# EAGLE design current_controller (EAGLE 8.5.0)
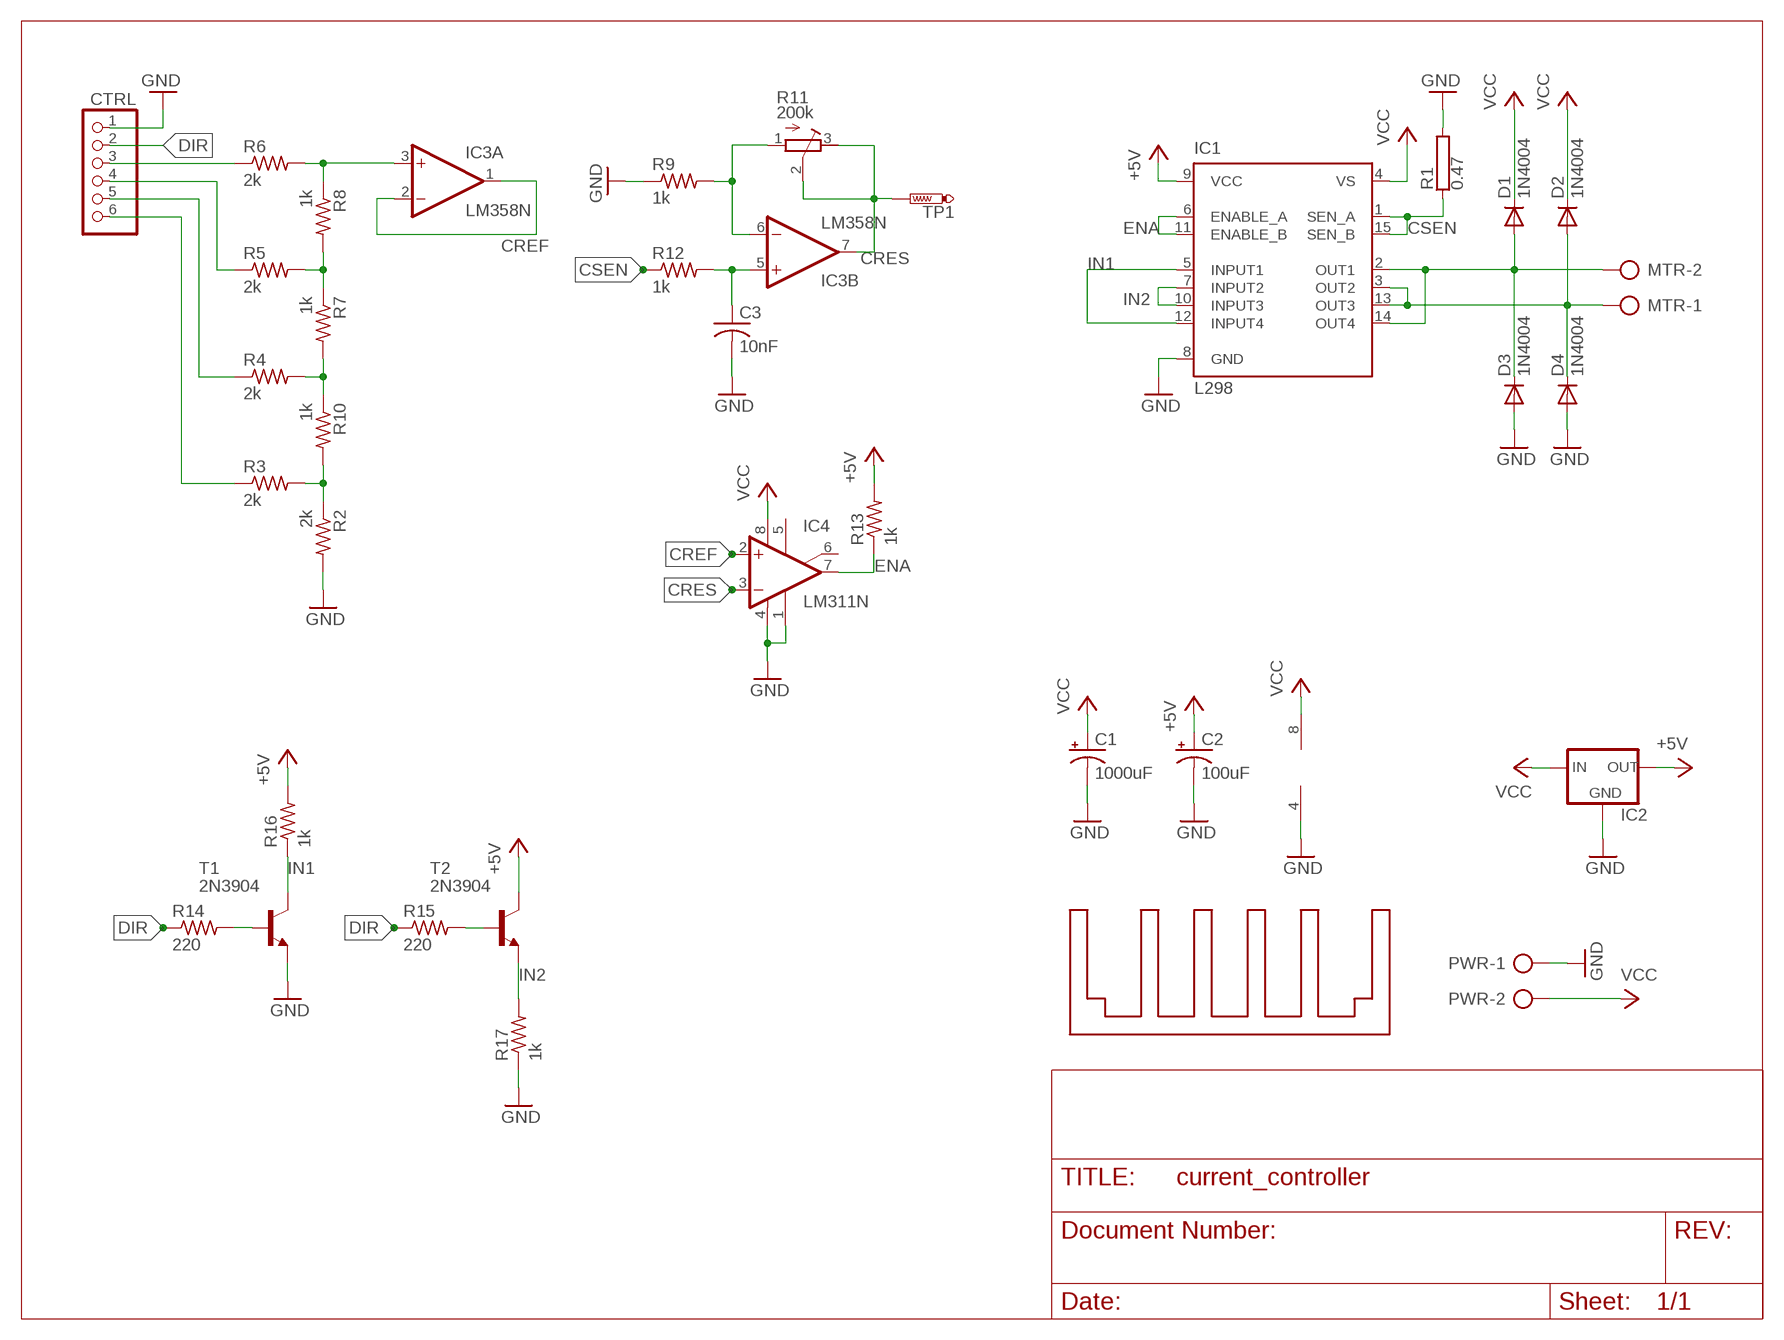
[diagram p0: schematic, sheet 1]

## Parts
C1  1000uF  CPOL-USE5-13  [E5-13]
C2  100uF  CPOL-USE5-8.5  [E5-8,5]
C3  10nF  C-US050-024X044  [C050-024X044]
CTRL  PINHD-1X6  [1X06]
D1  1N4004  [DO41-10]
D2  1N4004  [DO41-10]
D3  1N4004  [DO41-10]
D4  1N4004  [DO41-10]
IC1  L298  [MULTIWATT-15]
IC2  78XXS  [78XXS]
IC3  LM358N  [DIL08]
IC4  LM311N  [DIL08]
MTR  AK500/2  [AK500/2]
PWR  AK500/2  [AK500/2]
R1  0.47  RCA4080  [CA4080]
R2  2k  R-US_0204/7  [0204/7]
R3  2k  R-US_0204/7  [0204/7]
R4  2k  R-US_0204/7  [0204/7]
R5  2k  R-US_0204/7  [0204/7]
R6  2k  R-US_0204/7  [0204/7]
R7  1k  R-US_0204/7  [0204/7]
R8  1k  R-US_0204/7  [0204/7]
R9  1k  R-US_0204/7  [0204/7]
R10  1k  R-US_0204/7  [0204/7]
R11  200k  R-TRIMM64W  [RTRIM64W]
R12  1k  R-US_0204/7  [0204/7]
R13  1k  R-US_0204/7  [0204/7]
R14  220  R-US_0204/7  [0204/7]
R15  220  R-US_0204/7  [0204/7]
R16  1k  R-US_0204/7  [0204/7]
R17  1k  R-US_0204/7  [0204/7]
T1  2N3904  [TO92]
T2  2N3904  [TO92]
TP1  PTR1PAD1-13Y  [P1-13Y]
U$1  MULTI15_HEATSINK  [MULTI15_HEATSINK]

## Nets
+5V: C2.+ IC1.9(VCC) IC2.OUT R13.2 R16.2 T2.1(C)
CREF: IC3.1(A:OUT) IC3.2(A:-IN) IC4.2(+IN)
CRES: IC3.7(B:OUT) IC4.3(-IN) R11.2(S) R11.3(E) TP1.TP
CSEN: IC1.1(SEN_A) IC1.15(SEN_B) R1.1 R12.1
DIR: CTRL.2 R14.1 R15.1
ENA: IC1.6(ENABLE_A) IC1.11(ENABLE_B) IC4.7(OUT) R13.1
GND: C1.- C2.- C3.2 CTRL.1 D3.A D4.A IC1.8(GND) IC2.GND IC3.4(P:V-) IC4.1(GND) IC4.4(V-) PWR.1 R1.2 R2.2 R9.1 R17.1 T1.3(E)
IN1: IC1.5(INPUT1) IC1.12(INPUT4) R16.1 T1.1(C)
IN2: IC1.7(INPUT2) IC1.10(INPUT3) R17.2 T2.3(E)
N$1: D1.A D3.C IC1.2(OUT1) IC1.14(OUT4) MTR.2
N$2: D2.A D4.C IC1.3(OUT2) IC1.13(OUT3) MTR.1
N$3: R15.2 T2.2(B)
N$4: CTRL.3 R6.1
N$5: CTRL.4 R5.1
N$6: CTRL.5 R4.1
N$7: CTRL.6 R3.1
N$8: IC3.3(A:+IN) R6.2 R8.1
N$9: R5.2 R7.1 R8.2
N$10: R4.2 R7.2 R10.1
N$11: R2.1 R3.2 R10.2
N$12: IC3.6(B:-IN) R9.2 R11.1(A)
N$13: R14.2 T1.2(B)
N$16: C3.1 IC3.5(B:+IN) R12.2
VCC: C1.+ D1.C D2.C IC1.4(VS) IC2.IN IC3.8(P:V+) IC4.8(V+) PWR.2
Unconnected: IC4.5(ON) IC4.6(ON/STR)

## Library data of the parts
C1 C2 = resistor:CPOL-US: POLARIZED CAPACITOR, American symbol
C3 = resistor:C-US: CAPACITOR, American symbol
CTRL = pinhead:PINHD-1X6: PIN HEADER
D1-D4 = diode:1N4004: DIODE general purpose rectifier, 1 A
IC1 = st-microelectronics:L298: DUAL FULL-BRIDGE DRIVER; MPN: L298N; OC_FARNELL: 1589425; OC_NEWARK: 32M1527
IC2 = v-reg:78XXS: VOLTAGE REGULATOR
IC3 = linear:LM358: OP AMP also LM158; LM258; LM2904 Source: http://cache.national.com/ds/LM/LM158.pdf
IC4 = linear:LM311: COMPARATOR
MTR PWR = con-ptr500:AK500/2: CONNECTOR; OC_FARNELL: unknown; OC_NEWARK: unknown
R1 = resistor-power:R: Power Resitor; OC_FARNELL: unknown; OC_NEWARK: unknown
R2-R10 R12-R17 = resistor:R-US_: RESISTOR, American symbol
R11 = resistor:R-TRIMM: Trimm resistor
T1 T2 = transistor:2N3904: NPN TRANSISTOR
TP1 = testpad:PTR1: TEST PIN
U$1 = maplib:MULTI15_HEATSINK

## Board
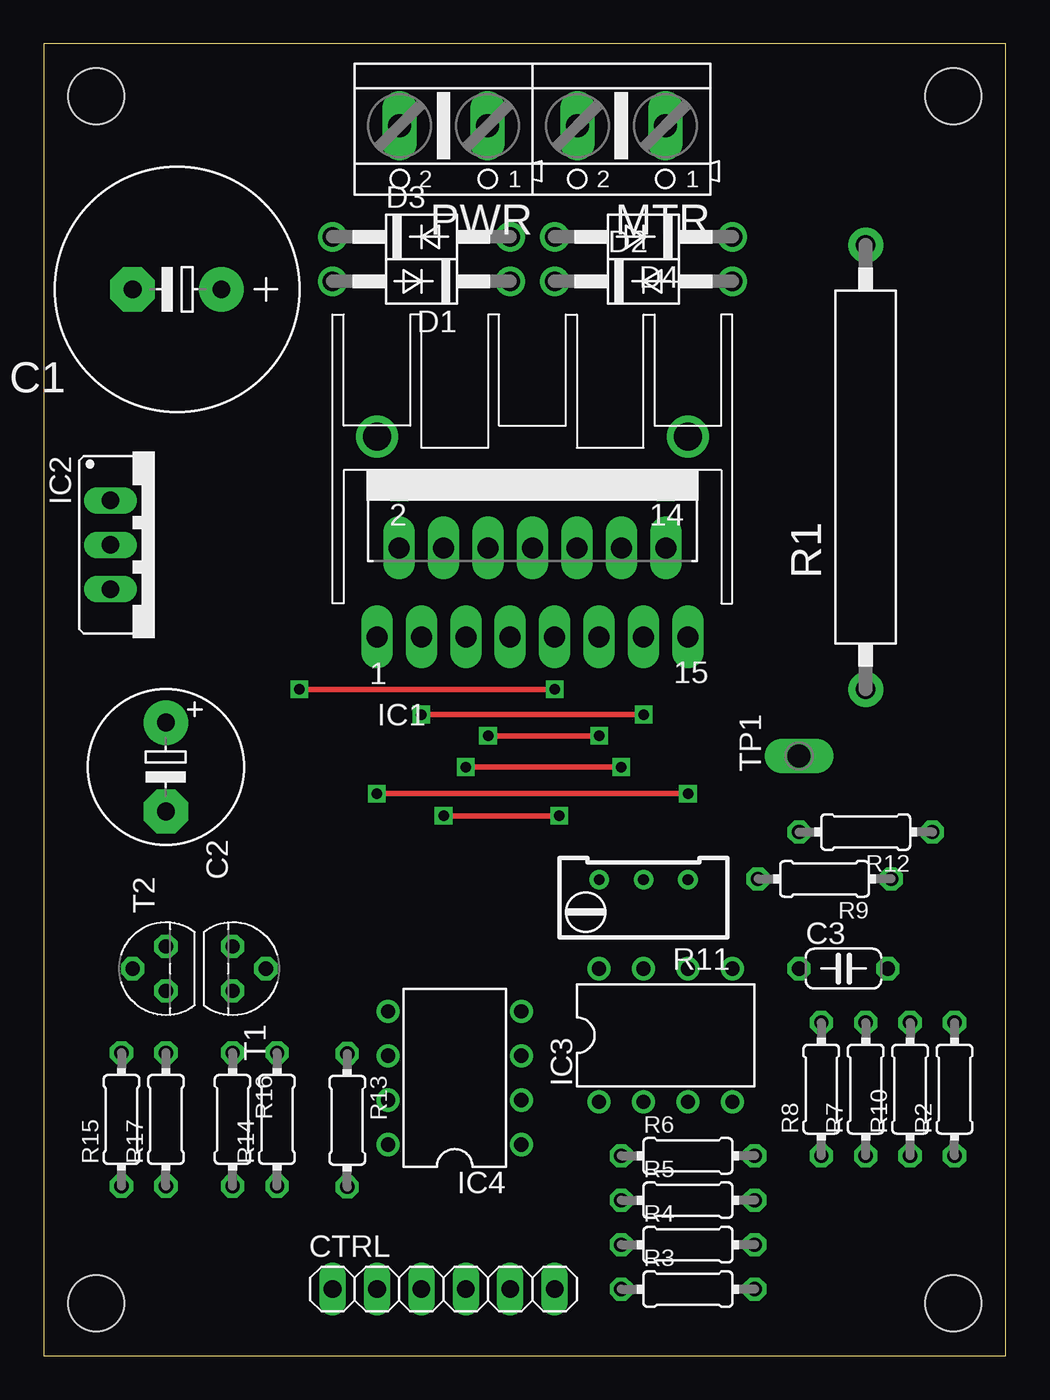
[diagram p1: board, top side]
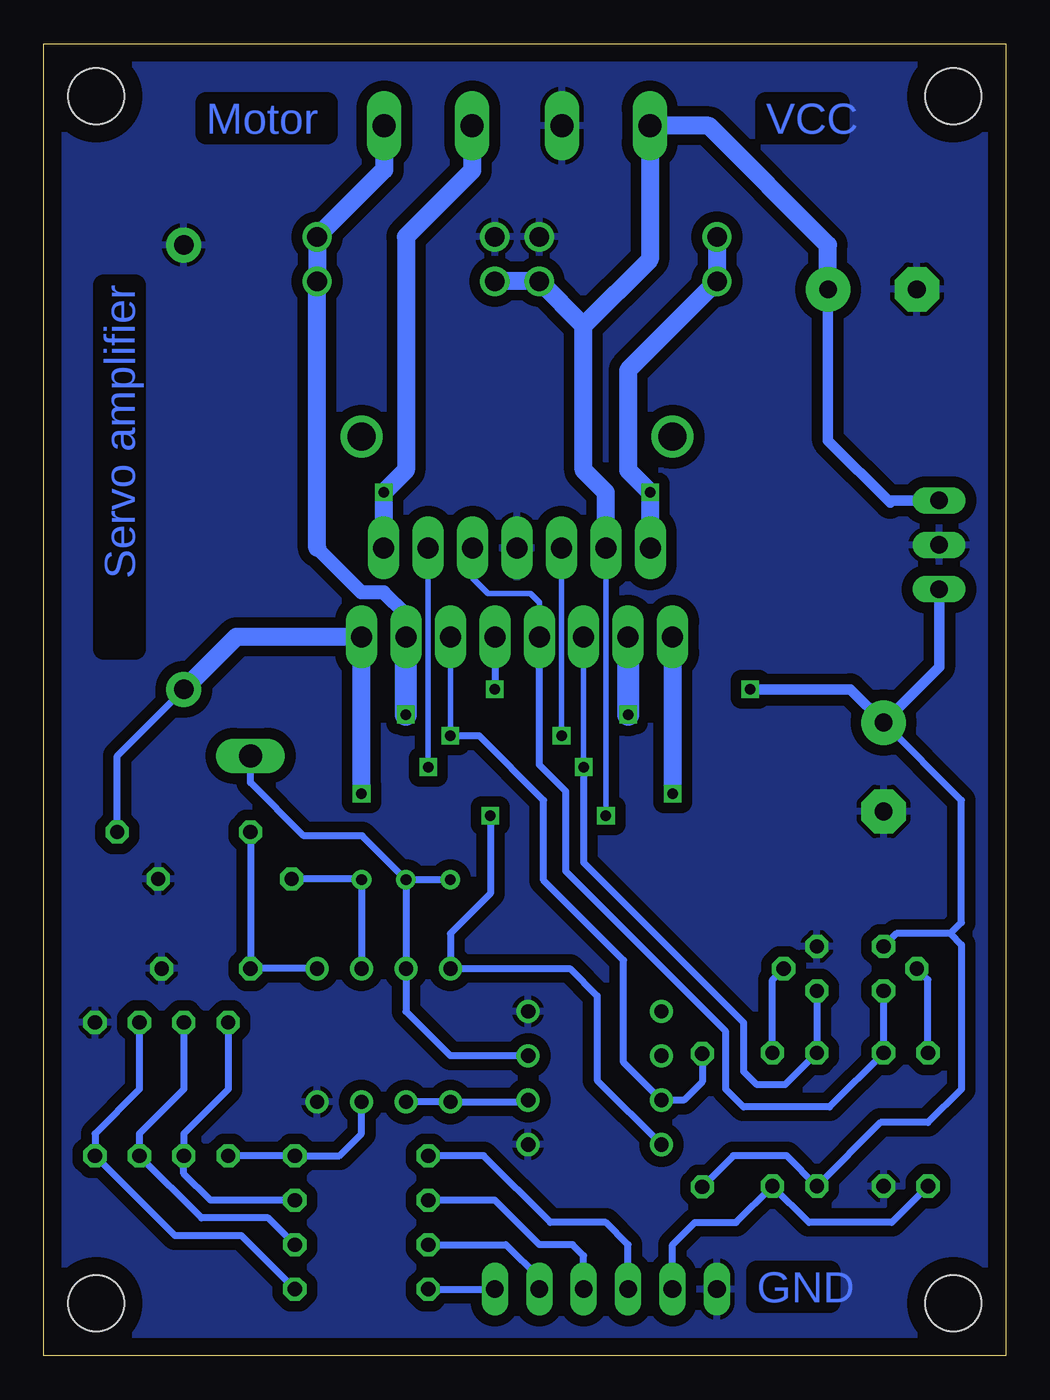
[diagram p2: board, bottom side, seen from below]

Size 55 x 75 mm. Coordinates in mm from the lower left corner, seen from the top.
Outline: 0,0 55,0 55,75 0,75 0,0
Copper layers (1*16): Top 0.035mm / dielectric 1.5mm / Bottom 0.035mm
Design rules "default": minimum track width 10mil, minimum drill 24mil, track to track 8mil, track to pad 8mil, pad to pad 8mil, via to via 8mil, smd to smd 8mil, copper to edge 40mil, drill to drill 8mil, minimum pad ring 10mil, minimum via ring 8mil, stop-mask expansion 4mil, vias tented up to drill 0mil, thermal gap 10mil
Holes 3.2 mm at 3,3 3,72 52,72 52,3

### Footprints (pad centres in the part's own frame; a part is rotated, then mirrored left to right if it is on the bottom)
E5-13 = drill 1.016 pad 2.54: + -2.54,0 | drill 1.016 pad 2.54 octagon: - 2.54,0
E5-8,5 = drill 1.016 pad 2.54: + -2.54,0 | drill 1.016 pad 2.54 octagon: - 2.54,0
C050-024X044 = drill 0.813 octagon: 1 -2.54,0; 2 2.54,0
1X06 = drill 1.016 long: 1 -6.35,0; 2 -3.81,0; 3 -1.27,0; 4 1.27,0; 5 3.81,0; 6 6.35,0
DO41-10 = drill 1.118: A 5.08,0; C -5.08,0
MULTIWATT-15 = drill 1.2 long: 1 -8.89,-7.62; 2 -7.62,-2.54; 3 -6.35,-7.62; 4 -5.08,-2.54; 5 -3.81,-7.62; 6 -2.54,-2.54; 7 -1.27,-7.62; 8 0,-2.54; 9 1.27,-7.62; 10 2.54,-2.54; 11 3.81,-7.62; 12 5.08,-2.54; 13 6.35,-7.62; 14 7.62,-2.54; 15 8.89,-7.62
78XXS = drill 1.016 long: GND 0,-2.54; IN -2.54,-2.54; OUT 2.54,-2.54
DIL08 = drill 0.813 pad 1.27: 1 -3.81,-3.81; 2 -1.27,-3.81; 3 1.27,-3.81; 4 3.81,-3.81; 5 3.81,3.81; 6 1.27,3.81; 7 -1.27,3.81; 8 -3.81,3.81
AK500/2 = drill 1.321 long: 1 -2.515,0; 2 2.515,0
CA4080 = drill 1.1 pad 2: 1 -12.7,0; 2 12.7,0
0204/7 = drill 0.813 octagon: 1 -3.81,0; 2 3.81,0
RTRIM64W = drill 0.61: 1 1.27,-2.54; 2 1.27,0; 3 1.27,2.54
TO92 = drill 0.813 octagon: 1 1.27,0; 2 0,1.905; 3 -1.27,0
P1-13Y = drill 1.321 pad 1.905 long: TP 0,0
MULTI15_HEATSINK = drill 1.6: P$1 -8.89,1.905; P$2 8.89,1.905

### Placement (x,y rotation side)
C1  7.62,60.96 180 top
C2  6.99,33.66 270 top
C3  45.72,22.13 0 top
CTRL  22.86,3.81 0 top
D1  21.59,61.42 180 top
D2  34.29,61.42 0 top
D3  21.59,63.96 0 top
D4  34.29,63.96 180 top
IC1  27.94,48.72 0 top
IC2  6.35,46.35 270 top
IC3  35.56,18.32 0 top
IC4  23.5,15.88 90 top
MTR  33.02,70.31 180 top
PWR  22.86,70.31 180 top
R1  46.99,50.8 90 top
R2  52.07,15.24 90 top
R3  36.83,3.81 0 top
R4  36.83,6.35 0 top
R5  36.83,8.89 0 top
R6  36.83,11.43 0 top
R7  46.99,15.24 90 top
R8  44.45,15.24 90 top
R9  44.64,27.26 180 top
R10  49.53,15.24 90 top
R11  34.29,25.94 90 top
R12  46.99,29.94 180 top
R13  17.35,13.46 270 top
R14  13.34,13.51 90 top
R15  4.45,13.51 90 top
R16  10.79,13.51 270 top
R17  6.99,13.51 90 top
T1  10.79,22.13 270 top
T2  6.99,22.13 90 top
TP1  43.18,34.29 90 top
U$1  27.94,50.62 0 top

### Tracks (layer width: path | path; a pad name or v marks a point on that pad's centre or on a via)
+5V  (via drill 0.6)
  Top 0.305: v29.21,38.1 v14.61,38.1
  Bottom 0.406: IC1.9 v29.21,38.1 | 3.17,24.13 2.54,23.5 2.54,15.24 4.45,13.34 7.16,13.34 R16.2 12.53,11.43 15.57,11.43 R13.2 | 3.17,24.13 2.54,24.77 2.54,31.75 C2.+ | 3.17,24.13 6.25,24.13 T2.1
  Bottom 0.61: v14.61,38.1 8.89,38.1 C2.+ 3.81,39.37 IC2.OUT
CREF
  Bottom 0.406: IC3.2 IC3.1 27.41,14.51 IC4.2
CRES
  Bottom 0.406: R11.3 R11.2 | R11.2 IC3.7 34.29,19.68 31.76,17.15 IC4.3 | R11.2 36.8,29.72 40.13,29.72 43.18,32.77 TP1.TP
CSEN  (via drill 0.6)
  Top 0.305: v19.05,32.13 v36.83,32.13
  Bottom 0.406: R1.1 50.8,34.29 R12.1
  Bottom 1.016: IC1.1 v19.05,32.13 | v36.83,32.13 IC1.15 43.99,41.1 R1.1
DIR
  Bottom 0.406: R15.1 6.53,7.62 11.26,7.62 R14.1 15.41,7.62 17.78,7.62 19.05,6.35 CTRL.2
ENA  (via drill 0.6)
  Top 0.305: v25.4,35.43 v31.75,35.43
  Bottom 0.305: IC1.6 v25.4,35.43 | v31.75,35.43 IC1.11
  Bottom 0.406: v31.75,35.43 30.1,35.43 26.42,31.75 26.42,27.18 21.84,22.61 21.84,16.77 IC4.7 18.41,14.61 17.35,15.67 R13.1
GND
  pour Bottom (isolate 0.61): 0,0 55,0 55,75 0,75
IN1  (via drill 0.6)
  Top 0.305: v24.13,33.66 v33.02,33.66
  Bottom 0.305: IC1.5 v24.13,33.66 | v33.02,33.66 IC1.12
  Bottom 0.406: T1.1 R16.1 12.62,15.49 14.22,15.49 14.99,16.26 14.99,19.05 19.05,23.11 24.13,28.19 v24.13,33.66
IN2
  Bottom 0.305: IC1.10 30.48,44.45 29.59,43.56 27.18,43.56 26.67,43.05 IC1.7
  Bottom 0.406: T2.3 R17.2 10.08,14.22 14.99,14.22 16,15.24 16,18.54 25.15,27.69 25.15,32.26 26.67,33.78 IC1.7
N$1  (via drill 0.6)
  Top 0.406: v20.32,49.35 v35.56,49.35
  Bottom 1.016: IC1.2 v20.32,49.35 21.59,50.62 21.59,56.34 D1.A D3.C | IC1.14 v35.56,49.35 34.29,50.62 34.29,63.96 30.5,67.75 MTR.2
N$2  (via drill 0.6)
  Top 0.305: v21.59,36.66 v34.29,36.66
  Bottom 0.813: 34.29,42.37 35.56,43.64 36.83,43.64 39.37,46.18
  Bottom 1.016: IC1.13 34.29,42.37 | 39.37,46.18 D2.A D4.C 35.53,67.8 MTR.1
  Bottom 1.27: IC1.3 v21.59,36.66 | v34.29,36.66 IC1.13
N$3
  Bottom 0.406: R15.2 4.45,21.5 T2.2
N$4
  Bottom 0.406: R6.1 29.84,11.43 26.04,7.62 22.86,7.62 21.59,6.35 CTRL.3
N$5
  Bottom 0.406: CTRL.4 24.13,5.71 24.77,6.35 26.67,6.35 29.21,8.89 R5.1
N$6
  Bottom 0.406: CTRL.5 26.67,4.45 28.57,6.35 R4.1
N$7
  Bottom 0.406: R3.1 CTRL.6
N$8
  Bottom 0.406: R8.1 R6.2 38.1,11.43 36.83,12.7 IC3.3
N$9
  Bottom 0.406: R8.2 44.45,15.24 46.99,12.7 R7.1 46.99,10.41 45.47,8.89 R5.2
N$10
  Bottom 0.406: R7.2 46.99,15.24 49.53,12.7 R10.1 45.97,7.87 42.16,7.87 R4.2
N$11
  Bottom 0.406: R10.2 49.53,15.24 52.07,12.7 R2.1 47.5,6.86 43.69,6.86 R3.2
N$12
  Bottom 0.406: IC3.6 R11.1 36.88,27.26 R9.2
N$13
  Bottom 0.406: R14.2 13.34,21.5 T1.2
N$16
  Bottom 0.406: IC3.5 C3.1 R12.2
VCC  (via drill 0.6)
  Top 0.305: v22.86,30.86 v29.46,30.86
  Bottom 0.305: IC1.4 v22.86,30.86
  Bottom 0.406: v29.46,30.86 29.46,26.42 31.75,24.13 IC3.8 24.92,22.13 23.37,20.57 23.37,15.76 IC4.8
  Bottom 0.61: IC2.IN 6.48,48.9 6.6,48.77 10.16,52.32 C1.+
  Bottom 1.016: IC1.4 22.86,49.35 24.13,50.62 24.13,58.88 | 24.13,58.88 D1.C D2.C | 24.13,58.88 20.34,62.66 PWR.2 16.97,70.31 10.16,63.5 C1.+

### Text on the board
Bottom: VCC | Motor | Servo amplifier | GND